# Altium project CW308T_M2351_Target.PrjPcb
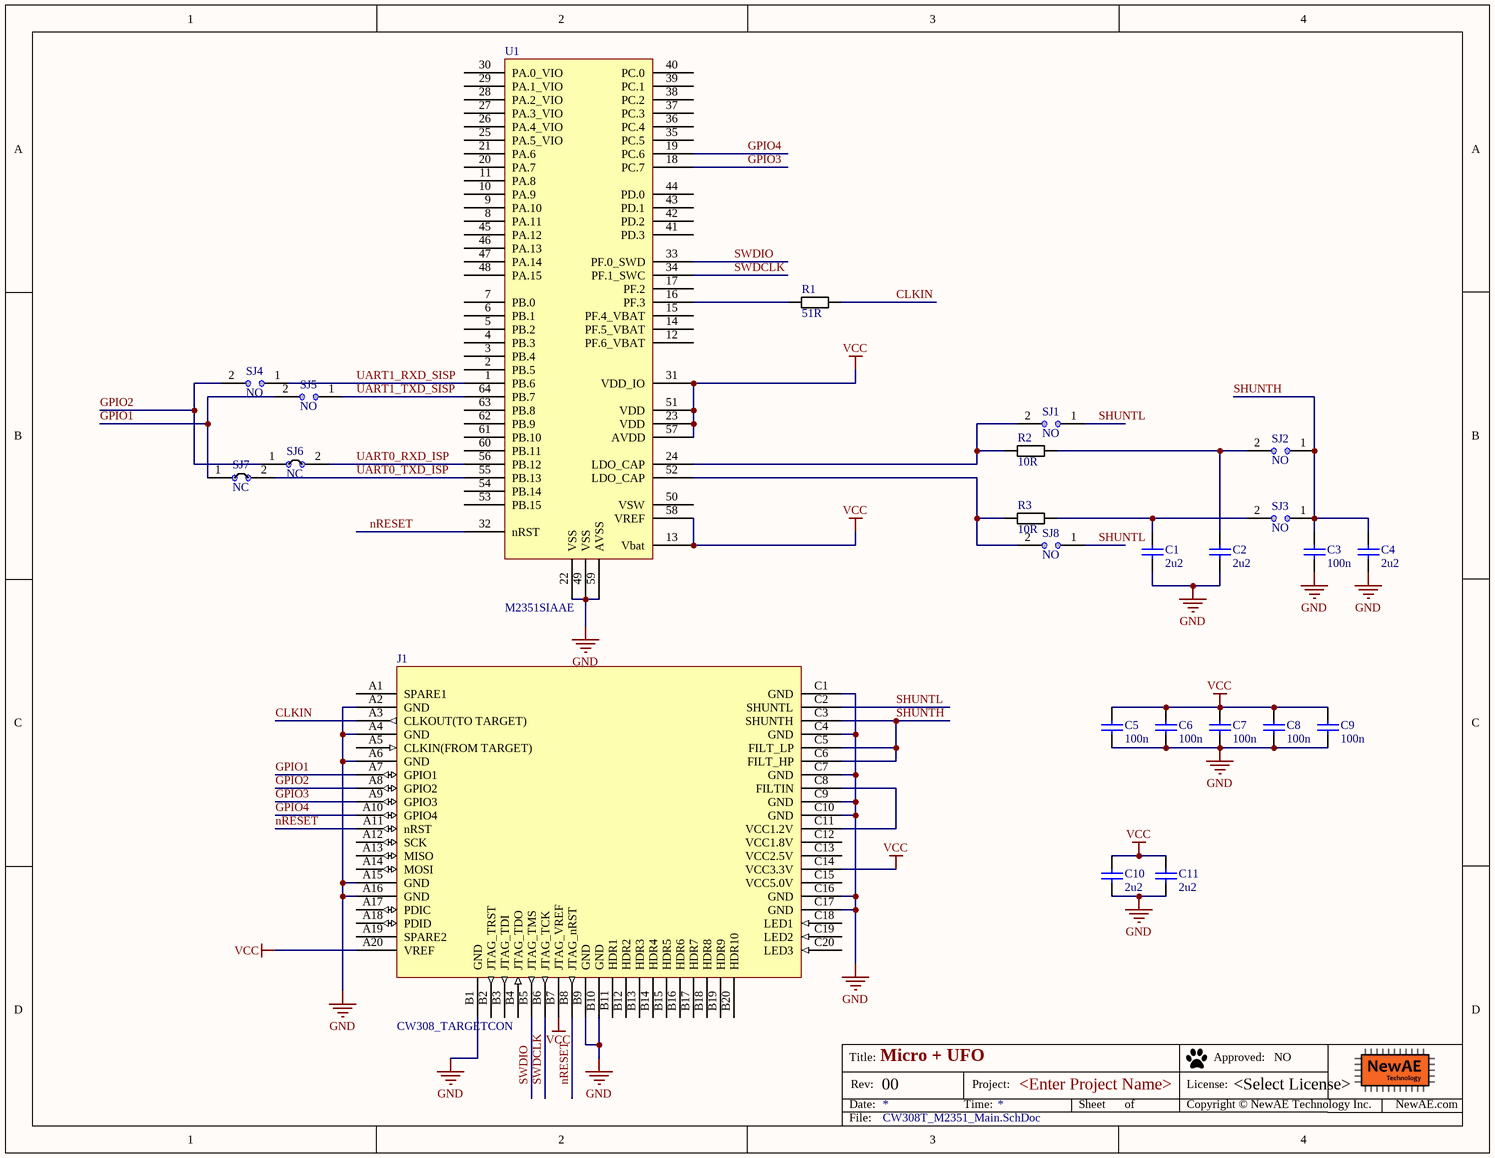
[diagram p0: CW308T_M2351_Main.SchDoc]
PrjLicense: <Select License>; PrjName: <Enter Project Name>; PrjRev: 00
1 sheet, 24 parts. Net scope: global (net labels, ports and power ports of the same name join across sheets).
Board files: CW308T_M2351_MainPCB.PcbDoc, CW308T_M2351_PANEL.PcbDoc

## Sheet CW308T_M2351_Main.SchDoc: Micro + UFO
size Letter; Organization: NewAE Technology Inc.; Address1: 1083 Queen St., Suite 196; Address2: Halifax; Address3: NS; Address4: Canada B3H 0B2; SheetApproved: NO

### Parts
C1  2u2  [CAPC0603_M]
C2  2u2  [CAPC0603_M]
C3  100n  [CAPC0603_M]
C4  2u2  [CAPC0603_M]
C5  100n  [CAPC0603_M]
C6  100n  [CAPC0603_M]
C7  100n  [CAPC0603_M]
C8  100n  [CAPC0603_M]
C9  100n  [CAPC0603_M]
C10  2u2  [CAPC0603_M]
C11  2u2  [CAPC0603_M]
J1  CW308_TARGETCON  [CW308_TBOARD_CONN]
R1  51R  [RESC1608X55N]
R2  10R  [RESC1608X55N]
R3  10R  [RESC1608X55N]
SJ1  NO  [SJ_2S_NO]  (no BOM)
SJ2  NO  [SJ_2S_NO]  (no BOM)
SJ3  NO  [SJ_2S_NO]  (no BOM)
SJ4  NO  [SJ_2S_NO]  (no BOM)
SJ5  NO  [SJ_2S_NO]  (no BOM)
SJ6  NC  [SJ_2S_NC]  (no BOM)
SJ7  NC  [SJ_2S_NC]  (no BOM)
SJ8  NO  [SJ_2S_NO]  (no BOM)
U1  M2351SIAAE  [TQFP50P1200X1200X120-64N]

### Nets
GND: C1.2 C2.2 C3.2 C4.2 C5.2 C6.2 C7.2 C8.2 C9.2 C10.2 C11.2 J1.A2(GND) J1.A4(GND) J1.A6(GND) J1.A15(GND) J1.A16(GND) J1.B1(GND) J1.B9(GND) J1.B10(GND) J1.C1(GND) J1.C4(GND) J1.C7(GND) J1.C9(GND) J1.C10(GND) J1.C16(GND) J1.C17(GND) U1.22(VSS) U1.49(VSS) U1.59(AVSS)
VCC: C5.1 C6.1 C7.1 C8.1 C9.1 C10.1 C11.1 J1.A20(VREF) J1.B7(JTAG_VREF) J1.C14(VCC3.3V) U1.13(Vbat) U1.23(VDD) U1.31(VDD_IO) U1.51(VDD) U1.57(AVDD) U1.58(VREF)
CLKIN: J1.A3(CLKOUT(TO_TARGET)) R1.2
GPIO1: J1.A7(GPIO1) SJ5.2 SJ7.1
GPIO2: J1.A8(GPIO2) SJ4.2 SJ6.1
GPIO3: J1.A9(GPIO3) U1.18(PC.7)
GPIO4: J1.A10(GPIO4) U1.19(PC.6)
nRESET: J1.A11(nRST) J1.B8(JTAG_nRST) U1.32(nRST)
SHUNTH: C3.1 C4.1 J1.C3(SHUNTH) J1.C5(FILT_LP) J1.C6(FILT_HP) SJ2.1 SJ3.1
SHUNTL: J1.C2(SHUNTL) SJ1.1 SJ8.1
SWDCLK: J1.B6(JTAG_TCK) U1.34(PF.1_SWC)
SWDIO: J1.B5(JTAG_TMS) U1.33(PF.0_SWD)
UART0_RXD_ISP: SJ6.2 U1.56(PB.12)
UART0_TXD_ISP: SJ7.2 U1.55(PB.13)
UART1_RXD_SISP: SJ4.1 U1.1(PB.6)
UART1_TXD_SISP: SJ5.1 U1.64(PB.7)
NetC1_1: C1.1 R3.2 SJ3.2
NetC2_1: C2.1 R2.2 SJ2.2
NetJ1_C8: J1.C8(FILTIN) J1.C11(VCC1.2V)
NetR1_1: R1.1 U1.16(PF.3)
NetR2_1: R2.1 SJ1.2 U1.24(LDO_CAP)
NetR3_1: R3.1 SJ8.2 U1.52(LDO_CAP)

Not connected (* = marked no-connect by the designer): J1 A1(SPARE1) A5(CLKIN(FROM_TARGET)) A12(SCK) A13(MISO) A14(MOSI) A17(PDIC) A18(PDID) A19(SPARE2) B2(JTAG_TRST) B3(JTAG_TDI) B4(JTAG_TDO) B11(HDR1) B12(HDR2) B13(HDR3) B14(HDR4) B15(HDR5) B16(HDR6) B17(HDR7) B18(HDR8) B19(HDR9) B20(HDR10) C12(VCC1.8V) C13(VCC2.5V) C15(VCC5.0V) C18(LED1) C19(LED2) C20(LED3); U1 2(PB.5) 3(PB.4) 4(PB.3) 5(PB.2) 6(PB.1) 7(PB.0) 8(PA.11) 9(PA.10) 10(PA.9) 11(PA.8) 12(PF.6_VBAT) 14(PF.5_VBAT) 15(PF.4_VBAT) 17(PF.2) 20(PA.7) 21(PA.6) 25(PA.5_VIO) 26(PA.4_VIO) 27(PA.3_VIO) 28(PA.2_VIO) 29(PA.1_VIO) 30(PA.0_VIO) 35(PC.5) 36(PC.4) 37(PC.3) 38(PC.2) 39(PC.1) 40(PC.0) 41(PD.3) 42(PD.2) 43(PD.1) 44(PD.0) 45(PA.12) 46(PA.13) 47(PA.14) 48(PA.15) 50(VSW) 53(PB.15) 54(PB.14) 60(PB.11) 61(PB.10) 62(PB.9) 63(PB.8)

### Notes on the sheet
- Title:
- Date:
- Rev:
- Time:
- Project:
- Sheet
- of
- License:
- Copyright © NewAE Technology Inc.
- Approved:
- NewAE.com
- File:

### Library data of the parts
C1 C2 C4 C10 C11 = CCHIP-2u2-0603: 2u2, 0603; Manufacture 1: Samsung; Manufacture Part Number 1: CL10B225KP8NNNC; Component Group: Capacitor; Case-EIA: 0603; Case-Metric: 1608; Rated Voltage: 10VDC; Part Number: CCHIP-2u2-0603; Footprint: 0603; Pin Count: 2; Supplier 1: Digi-Key; Supplier Part Number 1: 1276-1134-2-ND; Value: 2u2; Mounting Technology: SMT; Component Kind: Standard; Component Type: Standard
C3 C5-C9 = CCHIP-100n-0603: 100n, 0603; Manufacture 1: Kemet; Manufacture Part Number 1: C0603C104K5RACTU; Component Group: Capacitor; Case-EIA: 0603; Case-Metric: 1608; Rated Voltage: 50VDC; Part Number: CCHIP-100n-0603; Footprint: 0603; Pin Count: 2; Supplier 1: Digi-Key; Supplier Part Number 1: 399-5089-2-ND; Value: 100n; Mounting Technology: SMT; Component Kind: Standard; Component Type: Standard
J1 = CW308_TBOARD: CW308 "Standard" Target Board Connector; Component Group: Mechanical; Pitch: 2.54mm; Part Number: CW308_TBOARD; Pin Count: 60; Mounting Technology: Through-hole; Component Kind: Standard; Component Type: Standard
R1 = RCHIP-51R-0603: 51R res, 0603, 1%, 1/10W; Manufacture 1: Yageo; Manufacture Part Number 1: RC0603FR-0751RL; Component Group: Resistor; Case-EIA: 0603; Case-Metric: 1608; Rated Power: 0.1W; Rated Voltage: 75VDC; Part Number: RCHIP-51R-0603; Footprint: 0603; Pin Count: 2; Supplier 1: Digi-Key; Supplier Part Number 1: 311-51.0HRCT-ND; Value: 51R; Tolerance: 1%; Mounting Technology: SMT; Temperature Range: -55C to 155C; Component Kind: Standard; Component Type: Standard
R2 R3 = RCHIP-10R-0603: 10R res, 0603, 1%, 1/10W; Manufacture 1: Yageo; Manufacture Part Number 1: RC0603FR-0710RL; Component Group: Resistor; Case-EIA: 0603; Case-Metric: 1608; Rated Power: 0.1W; Rated Voltage: 75VDC; Part Number: RCHIP-10R-0603; Footprint: 0603; Pin Count: 2; Supplier 1: Digi-Key; Supplier Part Number 1: 311-10.0HRCT-ND; Value: 10R; Tolerance: 1%; Mounting Technology: SMT; Temperature Range: -55C to 155C; Component Kind: Standard; Component Type: Standard
SJ1-SJ5 SJ8 = SJ_2S_NO: Solder Jumper, NO; Component Group: PCB Feature; Part Number: SJ_2S_NO; Pin Count: 2; Mounting Technology: COPPER; Component Type: Standard (No BOM)
SJ6 SJ7 = SJ_2S: Solder Jumper, NC; Component Group: PCB Feature; Part Number: SJ_2S; Pin Count: 2; Mounting Technology: COPPER; Component Type: Standard (No BOM)
U1 = M2351SIAAE: Cortex M23 Device, QFP64; Manufacture 1: Nuvoton; Component Group: Digital IC; PP Material Stack: 0; Part Number: M2351SIAAE; Footprint: TQFP64; Manufacture Part Number 1: M2351SIAAE; Pin Count: 64; Component Kind: Standard; Component Type: Standard; PP Rotation: 0